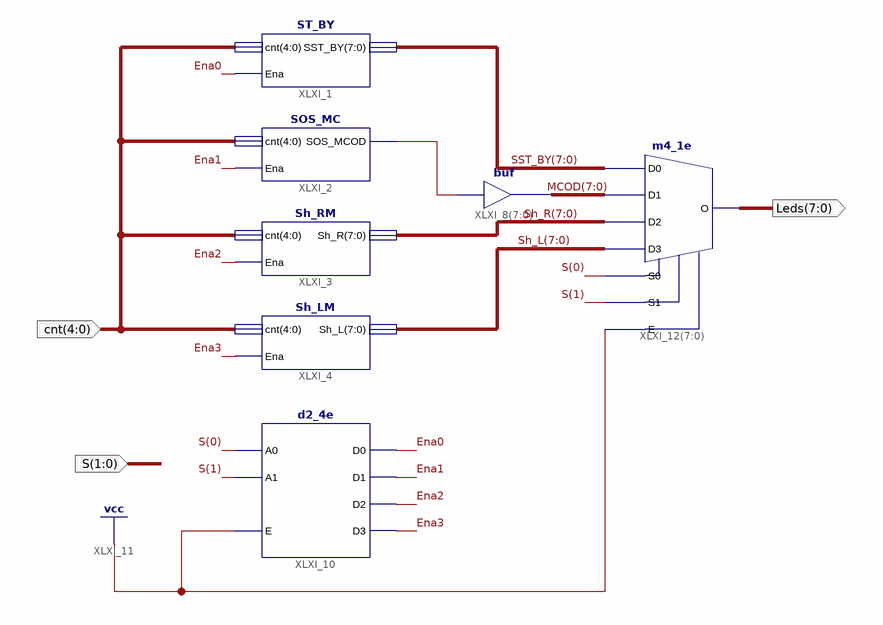
[diagram p0: schematic sheet 1]
// Xilinx ISE schematic MSignal.sch (spartan6) as structural Verilog: 7 symbols, 3 ports
module MSignal (
  input  [4:0] cnt,
  input  [1:0] S,
  output [7:0] Leds
);

  wire Ena0, Ena1, Ena2, Ena3, XLXN_11;
  wire [7:0] MCOD, Sh_L, Sh_R, SST_BY;

  ST_BY XLXI_1 (.cnt(cnt), .Ena(Ena0), .SST_BY(SST_BY));
  SOS_MC XLXI_2 (.cnt(cnt), .Ena(Ena1), .SOS_MCOD(XLXN_11));
  Sh_RM XLXI_3 (.cnt(cnt), .Ena(Ena2), .Sh_R(Sh_R));
  Sh_LM XLXI_4 (.cnt(cnt), .Ena(Ena3), .Sh_L(Sh_L));
  assign MCOD = {8{XLXN_11}};  // buf XLXI_8[7..0], 8 bits wide
  d2_4e XLXI_10 (.A0(S[0]), .A1(S[1]), .E(1'b1), .D0(Ena0), .D1(Ena1), .D2(Ena2), .D3(Ena3));
  m4_1e XLXI_12[7:0] (.D0(SST_BY), .D1(MCOD), .D2(Sh_R), .D3(Sh_L), .E(1'b1), .S0(S[0]), .S1(S[1]), .O(Leds));
endmodule
